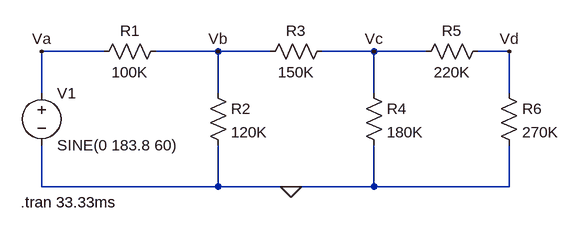
[diagram p0: schematic powerReference.asc]
powerReference.asc, the LTspice schematic file:
Version 4
SHEET 1 880 680
WIRE 16 64 -80 64
WIRE 192 64 96 64
WIRE 272 64 192 64
WIRE 432 64 352 64
WIRE 512 64 432 64
WIRE 640 64 592 64
WIRE -80 128 -80 64
WIRE 192 128 192 64
WIRE 432 128 432 64
WIRE 640 128 640 64
WIRE -80 272 -80 208
WIRE 192 272 192 208
WIRE 192 272 -80 272
WIRE 304 272 192 272
WIRE 432 272 432 208
WIRE 432 272 304 272
WIRE 640 272 640 208
WIRE 640 272 432 272
FLAG 304 272 0
FLAG -80 64 Va
FLAG 192 64 Vb
FLAG 432 64 Vc
FLAG 640 64 Vd
SYMBOL voltage -80 112 R0
WINDOW 123 0 0 Left 2
WINDOW 39 0 0 Left 2
SYMATTR InstName V1
SYMATTR Value SINE(0 183.8 60)
SYMBOL res 0 80 R270
WINDOW 0 32 56 VTop 2
WINDOW 3 0 56 VBottom 2
SYMATTR InstName R1
SYMATTR Value 100K
SYMBOL res 176 112 R0
SYMATTR InstName R2
SYMATTR Value 120K
SYMBOL res 416 112 R0
SYMATTR InstName R4
SYMATTR Value 180K
SYMBOL res 256 80 R270
WINDOW 0 32 56 VTop 2
WINDOW 3 0 56 VBottom 2
SYMATTR InstName R3
SYMATTR Value 150K
SYMBOL res 496 80 R270
WINDOW 0 32 56 VTop 2
WINDOW 3 0 56 VBottom 2
SYMATTR InstName R5
SYMATTR Value 220K
SYMBOL res 624 112 R0
SYMATTR InstName R6
SYMATTR Value 270K
TEXT -112 296 Left 2 !.tran 33.33ms

The netlist it stands for:
* powerReference.asc
V1 Va 0 SINE(0 183.8 60)
R1 Va Vb 100K
R2 Vb 0 120K
R4 Vc 0 180K
R3 Vb Vc 150K
R5 Vc Vd 220K
R6 Vd 0 270K
.tran 33.33ms
.backanno
.end